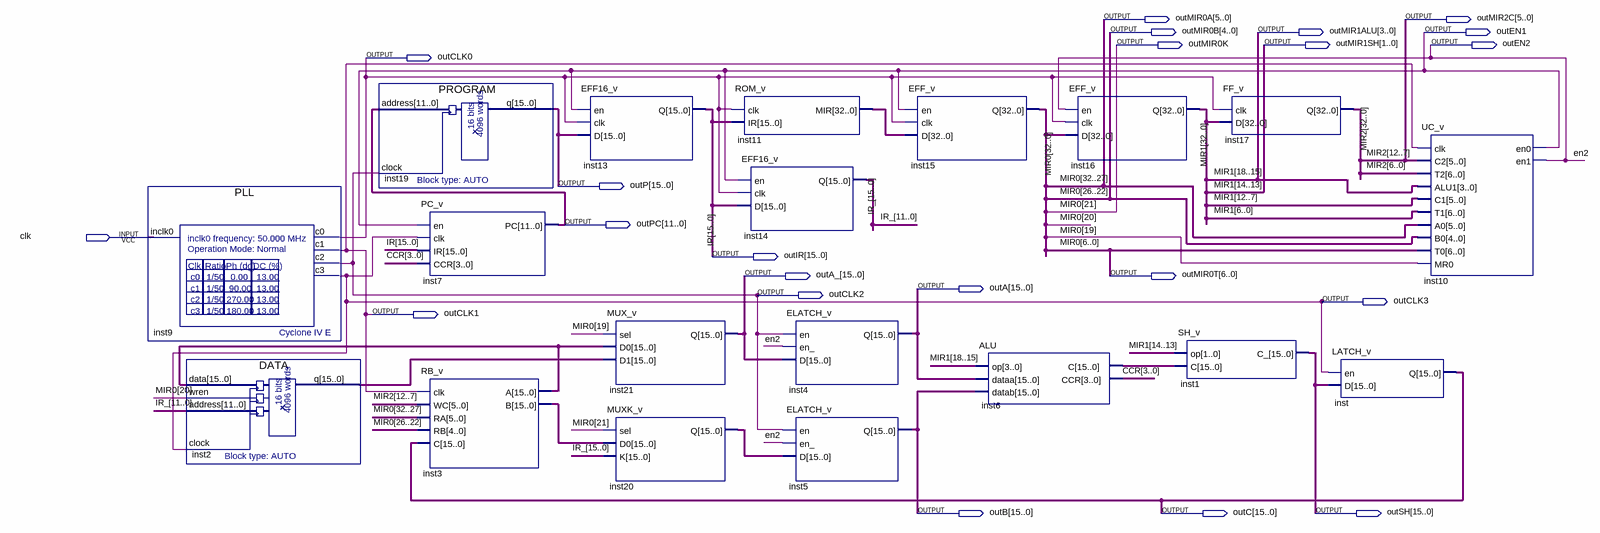
[diagram p0: schematic sheet]
// Quartus schematic CPU.bdf as structural Verilog: 19 symbols, 22 pins
module CPU (
  input  clk,
  output [5:0] outMIR0A,
  output [5:0] outMIR2C,
  output [4:0] outMIR0B,
  output [3:0] outMIR1ALU,
  output outEN1,
  output outMIR0K,
  output [1:0] outMIR1SH,
  output outEN2,
  output outCLK0,
  output [15:0] outP,
  output [11:0] outPC,
  output [15:0] outIR,
  output [15:0] outA_,
  output [6:0] outMIR0T,
  output [15:0] outA,
  output outCLK2,
  output outCLK3,
  output outCLK1,
  output [15:0] outB,
  output [15:0] outC,
  output [15:0] outSH
);

  wire [3:0] CCR;
  wire [15:0] inst2_q, inst3_a, inst3_b, inst6_c, inst20_q, IR_;
  wire [20:7] MIR0;
  wire [32:0] inst11_mir, MIR1, MIR2;

  PLL inst9 (.inclk0(clk), .c0(outCLK0), .c1(outCLK1), .c2(outCLK2), .c3(outCLK3));
  DATA inst2 (.data(inst3_a), .wren(MIR0[20]), .address(IR_[11:0]), .clock(outCLK3), .q(inst2_q));
  PROGRAM inst19 (.address(outPC), .clock(outCLK2), .q(outP));
  PC_v inst7 (.en(outEN1), .clk(outCLK3), .IR(outIR), .CCR(CCR), .PC(outPC));
  RB_v inst3 (.clk(outCLK1), .WC(outMIR2C), .RA(outMIR0A), .RB(outMIR0B), .C(outC), .A(inst3_a), .B(inst3_b));
  EFF16_v inst13 (.en(outEN1), .clk(outCLK0), .D(outP), .Q(outIR));
  MUX_v inst21 (.sel(MIR0[19]), .D0(inst3_a), .D1(inst2_q), .Q(outA_));
  MUXK_v inst20 (.sel(outMIR0K), .D0(inst3_b), .K(IR_), .Q(inst20_q));
  ROM_v inst11 (.clk(outCLK0), .IR(outIR), .MIR(inst11_mir));
  EFF16_v inst14 (.en(outEN1), .clk(outCLK0), .D(outIR), .Q(IR_));
  ELATCH_v inst4 (.en(outCLK2), .en_(outEN2), .D(outA_), .Q(outA));
  ELATCH_v inst5 (.en(outCLK2), .en_(outEN2), .D(inst20_q), .Q(outB));
  EFF_v inst15 (.en(outEN1), .clk(outCLK0), .D(inst11_mir), .Q({outMIR0A, outMIR0B, outMIR0K, MIR0, outMIR0T}));
  ALU inst6 (.op(outMIR1ALU), .dataa(outA), .datab(outB), .C(inst6_c), .CCR(CCR));
  EFF_v inst16 (
    .en(outEN2), .clk(outCLK0), .D({outMIR0A, outMIR0B, outMIR0K, MIR0, outMIR0T}),
    .Q({MIR1[32:19], outMIR1ALU, outMIR1SH, MIR1[12:0]}));
  SH_v inst1 (.op(outMIR1SH), .C(inst6_c), .C_(outSH));
  FF_v inst17 (
    .clk(outCLK0), .D({MIR1[32:19], outMIR1ALU, outMIR1SH, MIR1[12:0]}),
    .Q({MIR2[32:13], outMIR2C, MIR2[6:0]}));
  LATCH_v inst (.en(outCLK3), .D(outSH), .Q(outC));
  UC_v inst10 (
    .clk(outCLK1), .C2(outMIR2C), .T2(MIR2[6:0]), .ALU1(outMIR1ALU), .C1(MIR1[12:7]), .T1(MIR1[6:0]),
    .A0(outMIR0A), .B0(outMIR0B), .T0(outMIR0T), .MR0(MIR0[19]), .en0(outEN1), .en1(outEN2));

  // Other names for the same wires on the sheet: IR[15:0] = outIR;
  //   MIR0 (some bits) = {outMIR0A, outMIR0B, outMIR0K, outMIR0T}; MIR1[18:13] = {outMIR1ALU, outMIR1SH};
  //   MIR2[12:7] = outMIR2C; en2 = outEN2
endmodule
